# EAGLE design Boczek_schm_BFRFLOOD (EAGLE 9.6.2)
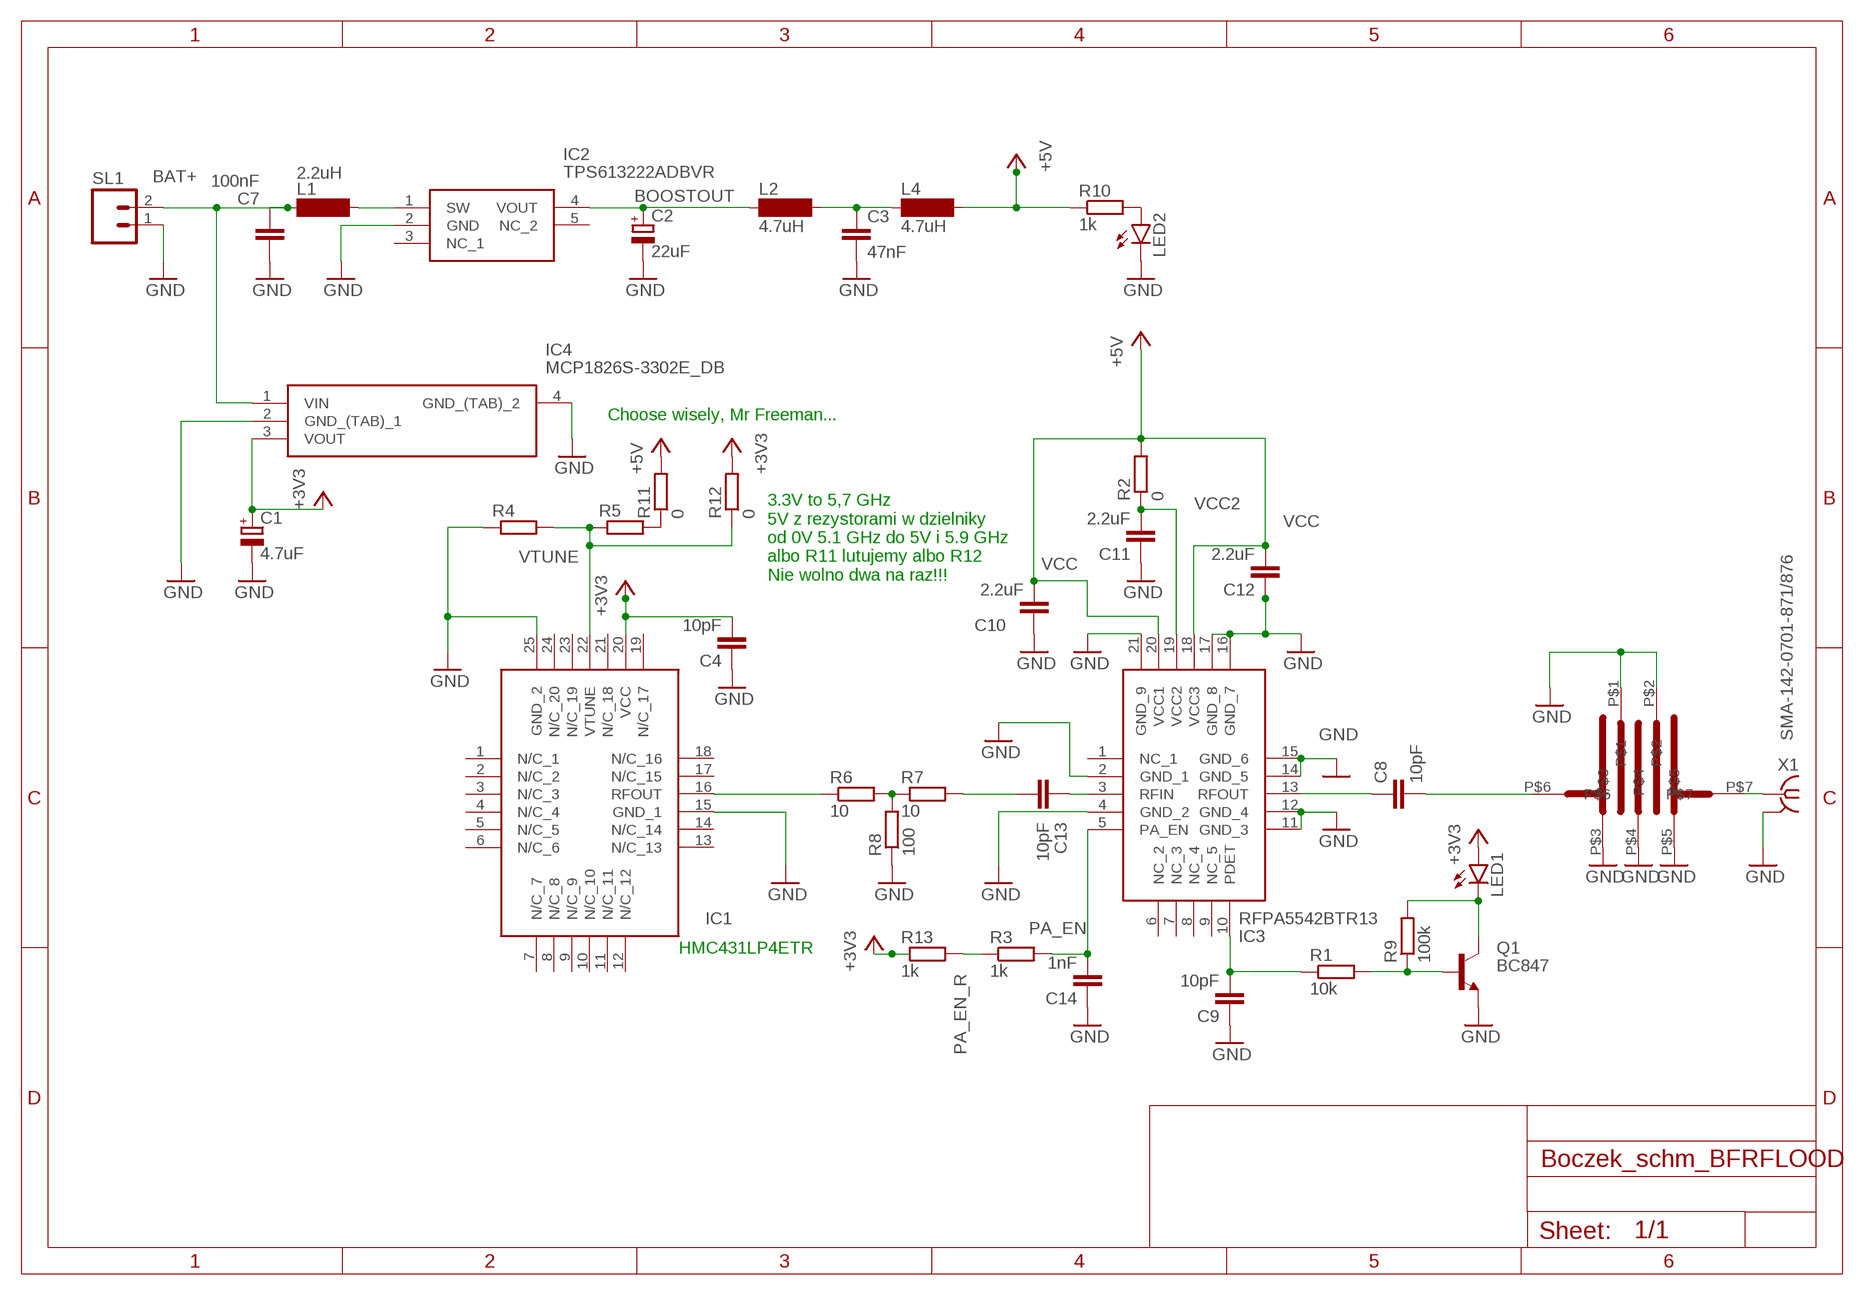
[diagram p0: schematic, sheet 1]

## Parts
C1  4.7uF  CPOL-EUSMCE  [SMC_E]
C2  22uF  CPOL-EUSMCE  [SMC_E]
C3  47nF  C-EUC1206  [C1206]
C4  10pF  C-EUC0603  [C0603]
C7  100nF  C-EUC1206  [C1206]
C8  10pF  C-EUC0402  [C0402]
C9  10pF  C-EUC0402  [C0402]
C10  2.2uF  C-EUC0402  [C0402]
C11  2.2uF  C-EUC0402  [C0402]
C12  2.2uF  C-EUC0402  [C0402]
C13  10pF  C-EUC0402  [C0402]
C14  1nF  C-EUC0402  [C0402]
FL1  INTERDIGITAL_FILTER_5TH_ORDER  [JLC7628_4900-5500_FILTER]
IC1  HMC430LP4ETR  [QFN50P400X400X100-25N]
IC2  TPS613222ADBVR  [SOT95P280X145-5N]
IC3  RFPA5542BTR13  [QFN50P400X400X85-21N]
IC4  MCP1826S-3302E_DB  [SOT230P700X180-4N]
L1  2.2uH  SM-NE45  [SM-NE45]
L2  4.7uH  SM-NE45  [SM-NE45]
L4  4.7uH  SM-NE45  [SM-NE45]
LED1  LEDSMT1206  [1206]
LED2  LEDSMT1206  [1206]
Q1  BC847  [SOT23]
R1  10k  R-EU_R0603  [R0603]
R2  0  R-EU_R0603  [R0603]
R3  1k  R-EU_R0603  [R0603]
R4  R-EU_R0603  [R0603]
R5  R-EU_R0603  [R0603]
R6  10  R-EU_R0603  [R0603]
R7  10  R-EU_R0603  [R0603]
R8  100  R-EU_R0603  [R0603]
R9  100k  R-EU_R0603  [R0603]
R10  1k  R-EU_R0603  [R0603]
R11  0  R-EU_R0603  [R0603]
R12  0  R-EU_R0603  [R0603]
R13  1k  R-EU_R0603  [R0603]
SL1  M02  [02P]
X1  SMA-142-0701-871/876  [J502-ND-142-0701-871/876]

## Nets
+3V3: C1.+ C4.2 IC1.20(VCC) IC4.3(VOUT) LED1.A R12.2 R13.1
+5V: L4.2 R10.1 R11.2
BAT+: C7.2 IC4.1(VIN) L1.1 SL1.2
BOOSTOUT: C2.+ IC2.4(VOUT) L2.1
GND [Gnd]: C1.- C2.- C3.2 C4.1 C7.1 C9.1 C10.1 C11.1 C12.1 C14.1 FL1.P$1 FL1.P$2 FL1.P$3 FL1.P$4 FL1.P$5 IC1.15(GND_1) IC1.25(GND_2) IC2.2(GND) IC3.2(GND_1) IC3.4(GND_2) IC3.11(GND_3) IC3.12(GND_4) IC3.14(GND_5) IC3.15(GND_6) IC3.16(GND_7) IC3.17(GND_8) IC3.21(GND_9) IC4.2(GND_(TAB)_1) IC4.4(GND_(TAB)_2) LED2.C Q1.2(E) R4.1 R8.1 SL1.1 X1.G@1 X1.G@2 X1.G@3 X1.G@4
N$1: FL1.P$7 X1.1
N$2: IC1.16(RFOUT) R6.1
N$3: R6.2 R7.1 R8.2
N$4: C13.1 IC3.3(RFIN)
N$5: LED2.A R10.2
N$6: C8.2 FL1.P$6
N$7: IC2.1(SW) L1.2
N$8: C13.2 R7.2
N$13: C9.2 IC3.10(PDET) R1.1
N$14: LED1.C Q1.3(C) R9.2
N$15: C3.1 L2.2 L4.1
N$16: Q1.1(B) R1.2 R9.1
N$17: C8.1 IC3.13(RFOUT)
N$19: R5.2 R11.1
PA_EN: C14.2 IC3.5(PA_EN) R3.2
PA_EN_R: R3.1 R13.2
VCC: C10.2 C12.2 IC3.18(VCC3) IC3.20(VCC1) R2.2 ; supply symbol labelled +5V
VCC2: C11.2 IC3.19(VCC2) R2.1
VTUNE: IC1.22(VTUNE) R4.2 R5.1 R12.1
Unconnected: IC1.1(N/C_1) IC1.2(N/C_2) IC1.3(N/C_3) IC1.4(N/C_4) IC1.5(N/C_5) IC1.6(N/C_6) IC1.7(N/C_7) IC1.8(N/C_8) IC1.9(N/C_9) IC1.10(N/C_10) IC1.11(N/C_11) IC1.12(N/C_12) IC1.13(N/C_13) IC1.14(N/C_14) IC1.17(N/C_15) IC1.18(N/C_16) IC1.19(N/C_17) IC1.21(N/C_18) IC1.23(N/C_19) IC1.24(N/C_20) IC2.3(NC_1) IC2.5(NC_2) IC3.1(NC_1) IC3.6(NC_2) IC3.7(NC_3) IC3.8(NC_4) IC3.9(NC_5)

## Notes on the sheet
- Choose wisely, Mr Freeman...
- 3.3V to 5,7 GHz 
  5V z rezystorami w dzielniky
  od 0V 5.1 GHz do 5V i 5.9 GHz 
  albo R11 lutujemy albo R12
  Nie wolno dwa na raz!!!
- HMC431LP4ETR

## Library data of the parts
C1 C2 = rcl:CPOL-EU: POLARIZED CAPACITOR, European symbol; SPICEPREFIX: C
C3 C4 C7-C14 = rcl:C-EU: CAPACITOR, European symbol; SPICEPREFIX: C
FL1 = Alex_RF:INTERDIGITAL_FILTER_5TH_ORDER: Generic symbol for 5-th order interdigital filter
IC1 = SamacSys_Parts:HMC430LP4ETR: VCO Oscillators VCO SMT w/Buffer amp, 5.0 - 5.5 GHz Source: Datasheet <https://www.analog.com/media/en/technical-documentation/data-sheets/hmc430.pdf>; DESCRIPTION: VCO Oscillators VCO SMT w/Buffer amp, 5.0 - 5.5 GHz; HEIGHT: 1mm; MANUFACTURER_NAME: Analog Devices; MANUFACTURER_PART_NUMBER: HMC431LP4ETR; MOUSER_PART_NUMBER: 584-HMC430LP4ETR; MOUSER_PRICE-STOCK: https://www.mouser.co.uk/ProductDetail/Analog-Devices/HMC430LP4ETR?qs=pceeu5JH%2FH8gg6v6ve1tvQ%3D%3D
IC2 = SamacSys_Parts:TPS613222ADBVR: 6-uA Quiescent Current, 1.8-A Switch Current Boost Converter Source: Datasheet <http://www.ti.com/lit/gpn/tps61322>; DESCRIPTION: 6-uA Quiescent Current, 1.8-A Switch Current Boost Converter; HEIGHT: 1.45mm; MANUFACTURER_NAME: Texas Instruments; MANUFACTURER_PART_NUMBER: TPS613222ADBVR; MOUSER_PART_NUMBER: 595-TPS613222ADBVR; MOUSER_PRICE-STOCK: https://www.mouser.co.uk/ProductDetail/Texas-Instruments/TPS613222ADBVR?qs=W0yvOO0ixfE4d69WXsn8NQ%3D%3D
IC3 = SamacSys_Parts:RFPA5542BTR13: RF Amplifier 5GHZ Discrete PA Source: Datasheet <https://www.mouser.pl/datasheet/2/412/RFPA5542 Data Sheet-1314453.pdf>; DESCRIPTION: RF Amplifier 5GHZ Discrete PA; HEIGHT: 0.85mm; MANUFACTURER_NAME: Qorvo; MANUFACTURER_PART_NUMBER: RFPA5542BTR13; MOUSER_PART_NUMBER: 772-RFPA5542BTR13; MOUSER_PRICE-STOCK: https://www.mouser.co.uk/ProductDetail/Qorvo/RFPA5542BTR13?qs=u4fy%2FsgLU9OIcUWfOD%252Bf6g%3D%3D
IC4 = SamacSys_Parts:MCP1826S-3302E_DB: LDO Regulator 1A 3.3V SOT223-3 MCP1826S-3302E/DB, Low Dropout Voltage Regulator, 1A, 3.3 V +/-2%, 2.3 6 Vin, 4-Pin SOT-223 Source: Datasheet <http://ww1.microchip.com/downloads/en/DeviceDoc/22057B.pdf>; DESCRIPTION: LDO Regulator 1A 3.3V SOT223-3 MCP1826S-3302E/DB, Low Dropout Voltage Regulator, 1A, 3.3 V +/-2%, 2.3 6 Vin, 4-Pin SOT-223; HEIGHT: 1.8mm; MANUFACTURER_NAME: Microchip; MANUFACTURER_PART_NUMBER: MCP1826S-3302E/DB; MOUSER_PART_NUMBER: 579-MCP1826S-3302EDB; MOUSER_PRICE-STOCK: https://www.mouser.co.uk/ProductDetail/Microchip-Technology-Atmel/MCP1826S-3302E-DB?qs=gsqZ4L1luKqjUo%2Fe%2Fgllfg%3D%3D
L1 L4 = inductor-neosid:SM-NE45: INDUCTOR SMD chip inductor; OC_FARNELL: unknown; OC_NEWARK: unknown
L2 = inductor-neosid:SM-NE45: INDUCTOR SMD chip inductor; OC_FARNELL: unknown; OC_NEWARK: unknown; SPICEPREFIX: L
LED1 LED2 = led:LED: LED OSRAM: - CHIPLED LG R971, LG N971, LY N971, LG Q971, LY Q971, LO R971, LY R971 LH N974, LH R974 LS Q976, LO Q976, LY Q976 LO Q996 - Hyper CHIPLED LW Q18S LB Q993, LB Q99A, LB R99A - SideLED LS A670, LO A670, LY A670, LG A670, LP A670 LB A673, LV A673, LT A673, LW A673 LH A674 LY A675 LS A676, LA A676, LO A676, LY A676, LW A676 LS A679, LY A679, LG A679 - Hyper Micro SIDELED® LS Y876, LA Y876, LO Y876, LY Y876 LT Y87S - SmartLED LW L88C, LW L88S LB L89C, LB L89S, LG L890 LS L89K, LO L89K, LY L89K LS L896, LA L896, LO L896, LY L896 - TOPLED LS T670, LO T670, LY T670, LG T670, LP T670 LSG T670, LSP T670, LSY T670, LOP T670, LYG T670 LG T671, LOG T671, LSG T671 LB T673, LV T673, LT T673, LW T673 LH T674 LS T676, LA T676, LO T676, LY T676, LB T676, LH T676, LSB T676, LW T676 LB T67C, LV T67C, LT T67C, LS T67K, LO T67K, LY T67K, LW E67C LS E67B, LA E67B, LO E67B, LY E67B, LB E67C, LV E67C, LT E67C LW T67C LS T679, LY T679, LG T679 LS T770, LO T770, LY T770, LG T770, LP T770 LB T773, LV T773, LT T773, LW T773 LH T774 LS E675, LA E675, LY E675, LS T675 LS T776, LA T776, LO T776, LY T776, LB T776 LHGB T686 LT T68C, LB T68C - Hyper Mini TOPLED® LB M676 - Mini TOPLED Santana® LG M470 LS M47K, LO M47K, LY M47K Source: http://www.osram.convergy.de LUXEON: - LUMILED® LXK2-PW12-R00, LXK2-PW12-S00, LXK2-PW14-U00, LXK2-PW14-V00 LXK2-PM12-R00, LXK2-PM12-S00, LXK2-PM14-U00 LXK2-PE12-Q00, LXK2-PE12-R00, LXK2-PE12-S00, LXK2-PE14-T00, LXK2-PE14-U00 LXK2-PB12-K00, LXK2-PB12-L00, LXK2-PB12-M00, LXK2-PB14-N00, LXK2-PB14-P00, LXK2-PB14-Q00 LXK2-PR12-L00, LXK2-PR12-M00, LXK2-PR14-Q00, LXK2-PR14-R00 LXK2-PD12-Q00, LXK2-PD12-R00, LXK2-PD12-S00 LXK2-PH12-R00, LXK2-PH12-S00 LXK2-PL12-P00, LXK2-PL12-Q00, LXK2-PL12-R00 Source: www.luxeon.com KINGBRIGHT: KA-3528ASYC Source: www.kingbright.com
Q1 = transistor:BC847: NPN TRANSISTOR
R1-R3 R10-R13 = rcl:R-EU_: RESISTOR, European symbol; SPICEPREFIX: R
R4-R9 = resistor:R-EU_: RESISTOR, European symbol
SL1 = con-amp-quick:M02: AMP QUICK CONNECTOR; OC_FARNELL: unknown; OC_NEWARK: unknown
X1 = con-coax:SMA-: SMA 50 Ohm End Launch Jack Receptacle - Round Contact Johnson Components Source: www.johnsoncomponents.com .. J502-ND.pdf; MF: JOHNSON COMPONENTS; MPN: 142-0701-871; OC_FARNELL: 1339835; OC_NEWARK: 91B6105

## Board
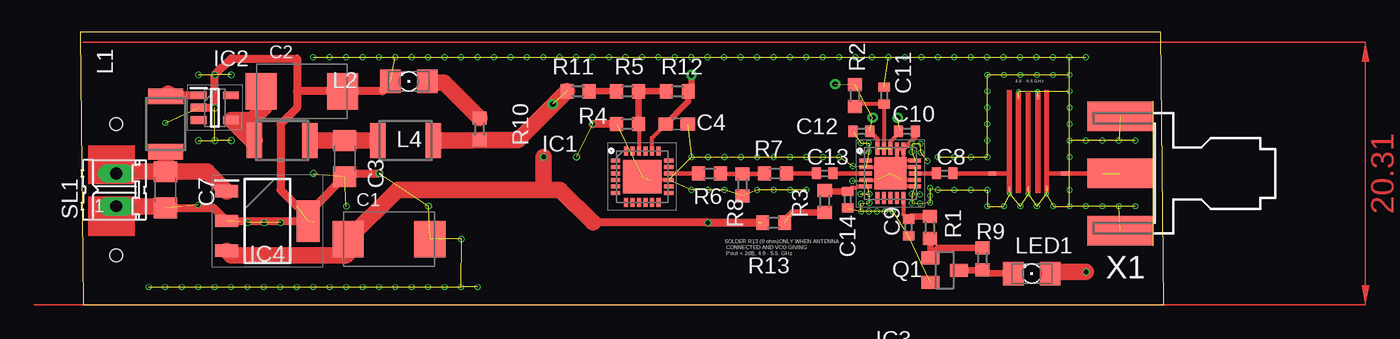
[diagram p1: board, top side]
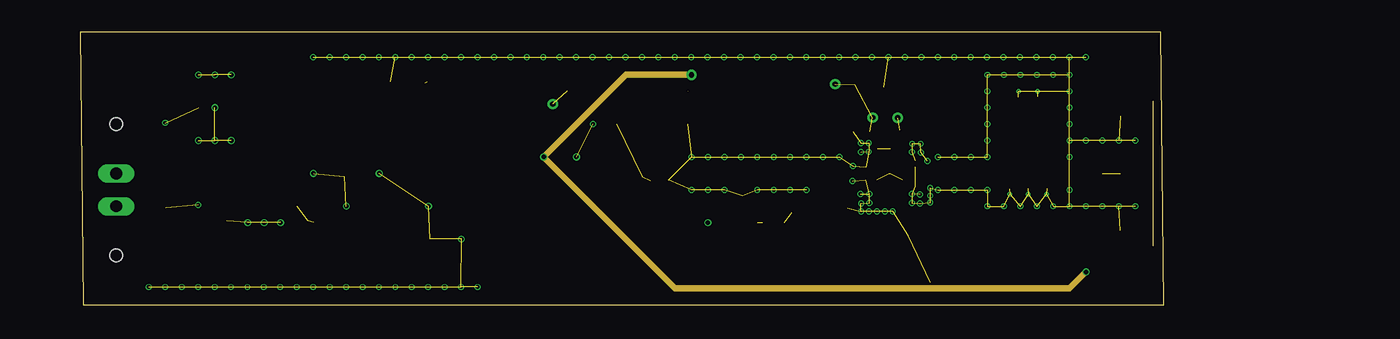
[diagram p2: board, inner layer Route15]
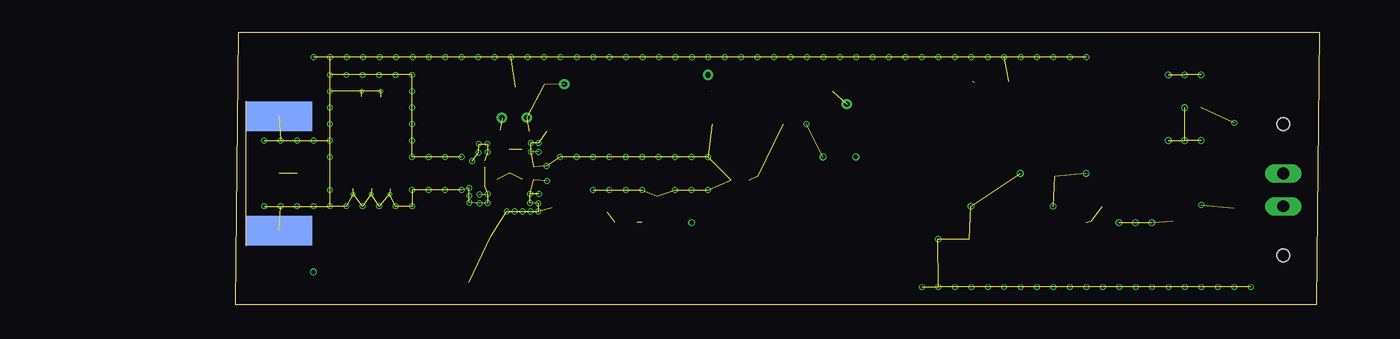
[diagram p3: board, bottom side, seen from below]

Size 83.74 x 21.07 mm. Coordinates in mm from the lower left corner, seen from the top.
Outline: 0.25,0 83.74,0 83.49,21.07 0,21.07 0.25,0
Copper layers (1+2*15+16): Top 0.035mm / dielectric 0.2104mm / Route2 0.035mm / dielectric 1.065mm / Route15 0.035mm / dielectric 0.2104mm / Bottom 0.035mm
Design rules "default *": minimum track width 6mil, minimum drill 0.2mm, track to track 6mil, track to pad 6mil, pad to pad 6mil, via to via 6mil, smd to smd 6mil, copper to edge 40mil, drill to drill 6mil, minimum pad ring 10mil, minimum via ring 3mil, stop-mask expansion 4mil, vias tented up to drill 0mil, thermal gap 10mil
Holes 1 mm at 2.79,13.97 2.79,3.81

### Footprints (pad centres in the part's own frame; a part is rotated, then mirrored left to right if it is on the bottom)
SMC_E = smd 2.4 x 2.8: + -3.15,0; - 3.15,0
C1206 = smd 1.6 x 1.8: 1 -1.4,0; 2 1.4,0
C0603 = smd 1.1 x 1: 1 -0.85,0; 2 0.85,0
C0402 = smd 0.7 x 0.9: 1 -0.65,0; 2 0.65,0
JLC7628_4900-5500_FILTER = smd 0.152 x 0.305: P$1 0.87,7.44; P$2 2.38,7.45; P$3 0.18,0.32; P$4 1.62,0.34; P$5 3.06,0.37 | smd 0.61 x 0.305: P$6 -1.155,1.53; P$7 4.445,1.51
QFN50P400X400X100-25N = smd 0.7 x 0.3: 1 -2.05,1.25; 2 -2.05,0.75; 3 -2.05,0.25; 4 -2.05,-0.25; 5 -2.05,-0.75; 6 -2.05,-1.25; 13 2.05,-1.25; 14 2.05,-0.75; 15 2.05,-0.25; 16 2.05,0.25; 17 2.05,0.75; 18 2.05,1.25 | smd 0.3 x 0.7: 7 -1.25,-2; 8 -0.75,-2; 9 -0.25,-2; 10 0.25,-2; 11 0.75,-2; 12 1.25,-2; 19 1.25,2; 20 0.75,2; 21 0.25,2; 22 -0.25,2; 23 -0.75,2; 24 -1.25,2 | smd 2.95 x 2.56: 25 0,0
SOT95P280X145-5N = smd 1.2 x 0.6: 1 -1.25,0.95; 2 -1.25,0; 3 -1.25,-0.95; 4 1.25,-0.95; 5 1.25,0.95
QFN50P400X400X85-21N = smd 0.95 x 0.3: 1 -1.9,1; 2 -1.9,0.5; 3 -1.9,0; 4 -1.9,-0.5; 5 -1.9,-1; 11 1.9,-1; 12 1.9,-0.5; 13 1.9,0; 14 1.9,0.5; 15 1.9,1 | smd 0.3 x 0.95: 6 -1,-1.9; 7 -0.5,-1.9; 8 0,-1.9; 9 0.5,-1.9; 10 1,-1.9; 16 1,1.9; 17 0.5,1.9; 18 0,1.9; 19 -0.5,1.9; 20 -1,1.9 | smd 2.5 x 2.5: 21 0,0
SOT230P700X180-4N = smd 1.75 x 0.95: 1 -3.15,2.3; 2 -3.15,0; 3 -3.15,-2.3 | smd 1.75 x 3.2: 4 3.15,0
SM-NE45 = smd 1.2 x 2.7: 1 -2.15,0; 2 2.15,0
1206 = smd 1.6 x 1.803: A -1.422,0; C 1.422,0
SOT23 = smd 1 x 1.4: 1 -0.95,-1.1; 2 0.95,-1.1; 3 0,1.1
R0603 = smd 1 x 1.1: 1 -0.85,0; 2 0.85,0
02P = drill 0.914 long: 1 -1.27,0; 2 1.27,0
J502-ND-142-0701-871/876 = smd 5.08 x 2.286: 1 2.565,0; G@1 2.565,4.42; G@2 2.565,-4.42 | smd 5.08 x 2.286 bottom: G@3 2.565,4.42; G@4 2.565,-4.42

### Placement (x,y rotation side)
C1  23.88,5.08 0 top
C2  17.14,16.51 0 top
C3  20.45,11.3 270 top
C4  46.1,13.97 180 top
C7  6.6,8.89 90 top
C8  66.8,10.16 0 top
C9  64.01,5.97 90 top
C10  63.88,13.41 180 top
C11  62.13,16.18 270 top
C12  60.38,13.41 0 top
C13  57.53,10.16 180 top
C14  59.31,8.13 90 top
FL1  71.63,8.64 0 top
IC1  43.43,9.91 0 top
IC2  10.41,15.24 0 top
IC3  62.61,10.16 0 top
IC4  14.48,6.48 0 top
L1  6.6,13.97 90 top
L2  15.62,12.7 0 top
L4  25.15,12.7 0 top
LED1  73.53,2.41 180 top
LED2  25.4,17.27 180 top
Q1  66.8,2.67 270 top
R1  65.66,5.97 270 top
R2  59.87,16.18 90 top
R3  57.53,8 90 top
R4  42.29,13.97 0 top
R5  42.29,16.51 180 top
R6  48.64,10.16 0 top
R7  53.72,10.16 0 top
R8  51.18,9.27 90 top
R9  69.72,3.56 270 top
R10  30.86,13.59 90 top
R11  38.48,16.51 180 top
R12  46.14,16.51 0 top
R13  53.59,6.35 0 top
SL1  2.79,8.89 90 top
X1  82.93,10.16 180 top

### Tracks (layer width: path | path; a pad name or v marks a point on that pad's centre or on a via)
+3V3  (via drill 0.35, 0.4 pad 0.8)  (2 unrouted)
  Top 0.305: IC1.20 44.18,12.9 45.04,13.76 C4.2
  Top 0.508: 45.04,13.76 46.99,15.71 R12.2 47.24,16.76 v47.24,17.78
  Top 0.61: 52.32,6.35 v48.51,6.35 39.62,6.35
  Top 1.27: IC4.3 11.68,3.82 11.68,3.81 20.57,3.81 20.73,3.96 C1.+ 24.54,8.89 35.81,8.89 | 39.62,6.35 37.08,8.89 35.81,8.89 | 35.81,8.89 v35.81,11.43 | LED1.A 74.93,2.54 v77.72,2.54
  Route15 0.508: v47.24,17.78 42.16,17.78 v35.81,11.43 45.97,1.27 76.45,1.27 v77.72,2.54
+5V  (via drill 0.4 pad 0.8)  (1 unrouted)
  Top 1.27: L4.2 30.29,12.7 R10.1 33.86,12.74 R11.2
  other vias: 36.53,15.52
BAT+
  Top 1.27: SL1.2 2.92,10.29 C7.2 | L1.1 C7.2 | C7.2 9.81,10.29 IC4.1
BOOSTOUT
  Top 1.27: L2.1 13.25,12.7 IC2.4 13.27,14.29 14.22,15.24 14.22,16.28 C2.+
GND  (via drill 0.2 pad 0.25, 0.3 pad 0.25, 0.35)  (185 unrouted)
  Top 0.305: IC1.15 44.12,9.66 44.09,9.63 | IC3.2 61.98,10.66 62.48,10.16 | IC3.4 61.53,9.66 61.57,9.7 | IC3.12 63.57,9.66 63.52,9.7 | IC3.11 63.41,9.16 63.4,9.14 | IC3.14 63.36,10.66 63.35,10.64 63.11,10.88 IC3.17 | IC3.15 63.52,11.16 | 63.52,11.16 63.36,11.16 63.35,11.18 | IC3.16 63.61,11.25 63.52,11.16
  Top 0.365: IC3.17 IC3.16 64.53,12.98 C10.1
  Top 0.61: 18.03,6.35 18.03,7.49 C3.2 20.7,10.16 v23.11,10.16 | C7.1 10.31,7.49 IC4.2 IC4.4 | 16.76,16.51 C2.- 23.37,16.51 LED2.C | 16.76,16.51 16.76,15.24 15.49,13.97 15.49,8.89 16.76,7.62 | IC2.2 v10.41,15.24 v10.41,17.78 11.68,19.05 16.76,19.05 16.76,16.51 | R4.1 v39.62,13.97
  Top 1.27: C7.1 6.47,7.62 SL1.1
  other vias: 38.35,11.43 29.46,5.08 26.92,7.62 48.51,11.43 72.52,16.51 73.99,16.51 73.25,8.56 74.68,8.56 71.83,8.56 49.78,11.43 47.24,11.43 47.24,8.89 48.51,8.89 49.78,8.89 51.05,11.43 52.32,11.43 53.59,11.43 54.86,11.43 56.13,11.43 57.4,11.43 58.67,11.43 52.32,8.89 53.59,8.89 54.86,8.89 56.13,8.89 76.45,11.43 76.45,12.7 76.45,13.97 76.45,15.24 76.45,16.51 77.72,12.7 78.99,12.7 80.26,12.7 81.53,12.7 76.45,8.89 76.45,7.62 77.72,7.62 78.99,7.62 80.26,7.62 81.53,7.62 75.18,7.62 73.91,7.62 72.64,7.62 71.37,7.62 70.1,7.62 70.1,8.89 68.83,8.89 67.56,8.89 66.29,8.89 10.41,12.7 9.14,12.7 9.14,17.78 11.68,17.78 11.68,12.7 12.95,6.35 14.22,6.35 15.49,6.35 18.03,10.16 20.57,7.62 64.26,8.56 64.26,11.81 60.93,11.84 60.99,8.56 60.99,7.87 60.3,8.56 60.35,7.85 64.26,7.87 64.9,8.53 64.9,7.85 64.97,11.79 64.95,12.45 64.29,12.45 60.93,12.5 60.32,12.5 60.32,11.81 65.68,9.04 65.46,11.13 59.69,9.58 59.72,10.74 60.35,7.21 60.96,7.21 61.57,7.21 62.18,7.21 62.79,7.21 65.68,8.43 65.68,7.9 18.01,19.15 19.28,19.15 20.55,19.15 21.82,19.15 23.09,19.15 24.36,19.15 25.63,19.15 26.9,19.15 28.17,19.15 29.44,19.15 30.71,19.15 31.98,19.15 33.25,19.15 34.52,19.15 35.79,19.15 37.06,19.15 38.33,19.15 39.6,19.15 40.87,19.15 42.14,19.15 43.41,19.15 44.68,19.15 45.95,19.15 47.22,19.15 48.49,19.15 49.76,19.15 51.03,19.15 52.3,19.15 53.57,19.15 54.84,19.15 56.11,19.15 57.38,19.15 58.65,19.15 59.92,19.15 61.19,19.15 62.46,19.15 63.73,19.15 65,19.15 66.27,19.15 67.54,19.15 68.81,19.15 70.08,19.15 71.35,19.15 72.62,19.15 73.89,19.15 75.16,19.15 76.43,19.15 77.7,19.15 5.31,1.37 6.58,1.37 7.85,1.37 9.12,1.37 10.39,1.37 11.66,1.37 12.93,1.37 14.2,1.37 15.47,1.37 16.74,1.37 18.01,1.37 19.28,1.37 20.55,1.37 21.82,1.37 24.36,1.37 23.09,1.37 25.63,1.37 26.9,1.37 28.17,1.37 29.44,1.37 30.71,1.37 6.58,14.07 9.12,7.72
GND1  (via drill 0.3 pad 0.25)  (13 unrouted)
  other vias: 72.64,17.78 73.91,17.78 75.18,17.78 76.45,17.78 70.1,17.78 71.37,17.78 70.1,16.51 70.1,15.24 70.1,13.97 70.1,12.7 70.1,11.43 68.83,11.43 67.56,11.43 66.29,11.43
N$1  (1 unrouted)
  Top 0.365: FL1.P$7 76.09,10.16 78.99,10.16
N$2
  Top 0.355: 47.24,10.16 R6.1 IC1.16
N$3
  Top 0.355: R7.1 52.83,10.12 R8.2 49.53,10.12 R6.2
N$4
  Top 0.355: IC3.3 C13.1
N$5  (1 unrouted)
  Top 1.27: R10.2 28.11,17.19 26.67,17.19
N$6
  Top 0.365: FL1.P$6 68.83,10.16 C8.2
N$7
  Top 0.61: IC2.1 6.67,16.19 L1.2
  Top 1.27: L1.2 6.81,16.33
N$8
  Top 0.355: C13.2 R7.2
N$13
  Top 0.305: IC3.10 63.61,7.02 C9.2
  Top 0.508: C9.2 64.21,6.82 R1.1
N$14
  Top 0.508: Q1.3 69.68,2.67 R9.2 70.02,2.41 LED1.C
N$15
  Top 1.27: L2.2 C3.1 | C3.1 | L4.1 C3.1
N$16
  Top 0.508: R1.2 65.7,5.08 65.7,3.81 | 65.7,3.81 Q1.1 | R9.1 66.3,4.41 65.7,3.81
N$17
  Top 0.355: C8.1 IC3.13
N$19
  Top 0.508: R11.1 R5.2
PA_EN
  Top 0.305: IC3.5 60.11,9.16 59.99,9.04 59.57,9.04 C14.2
  Top 0.508: C14.2 57.6,8.78 R3.2
PA_EN_R  (1 unrouted)
  Top 0.508: 54.19,6.35 54.99,7.15 R3.1
VCC  (via drill 0.4 pad 0.8)  (5 unrouted)
  Top 0.305: C10.2 63.23,13.24 62.61,12.62 IC3.18
  Top 0.365: IC3.20 61.61,12.83 C12.2
  Top 0.406: C12.2
  Top 0.508: C12.2 61.02,13.39 | C10.2 63.32,13.5
  other vias: 58.34,17.07 61.24,14.48 63.17,14.45
VCC2  (1 unrouted)
  Top 0.305: IC3.19 C11.2 60.07,15.53 R2.1
VTUNE
  Top 0.305: R4.2 43.18,13.93 IC1.22
  Top 0.508: R4.2 R5.1 R12.1
(copper drawn outside any net)
  shapes: Top area x4

### Text on the board
tNames: SOLDER R13 (0 ohm)ONLY WHEN ANTENNA / CONNECTED AND VCO GIVING / Pout < 2dB, 4.9 - 5.5. GHz